# EAGLE design BelaExpander (EAGLE 7.5.0)
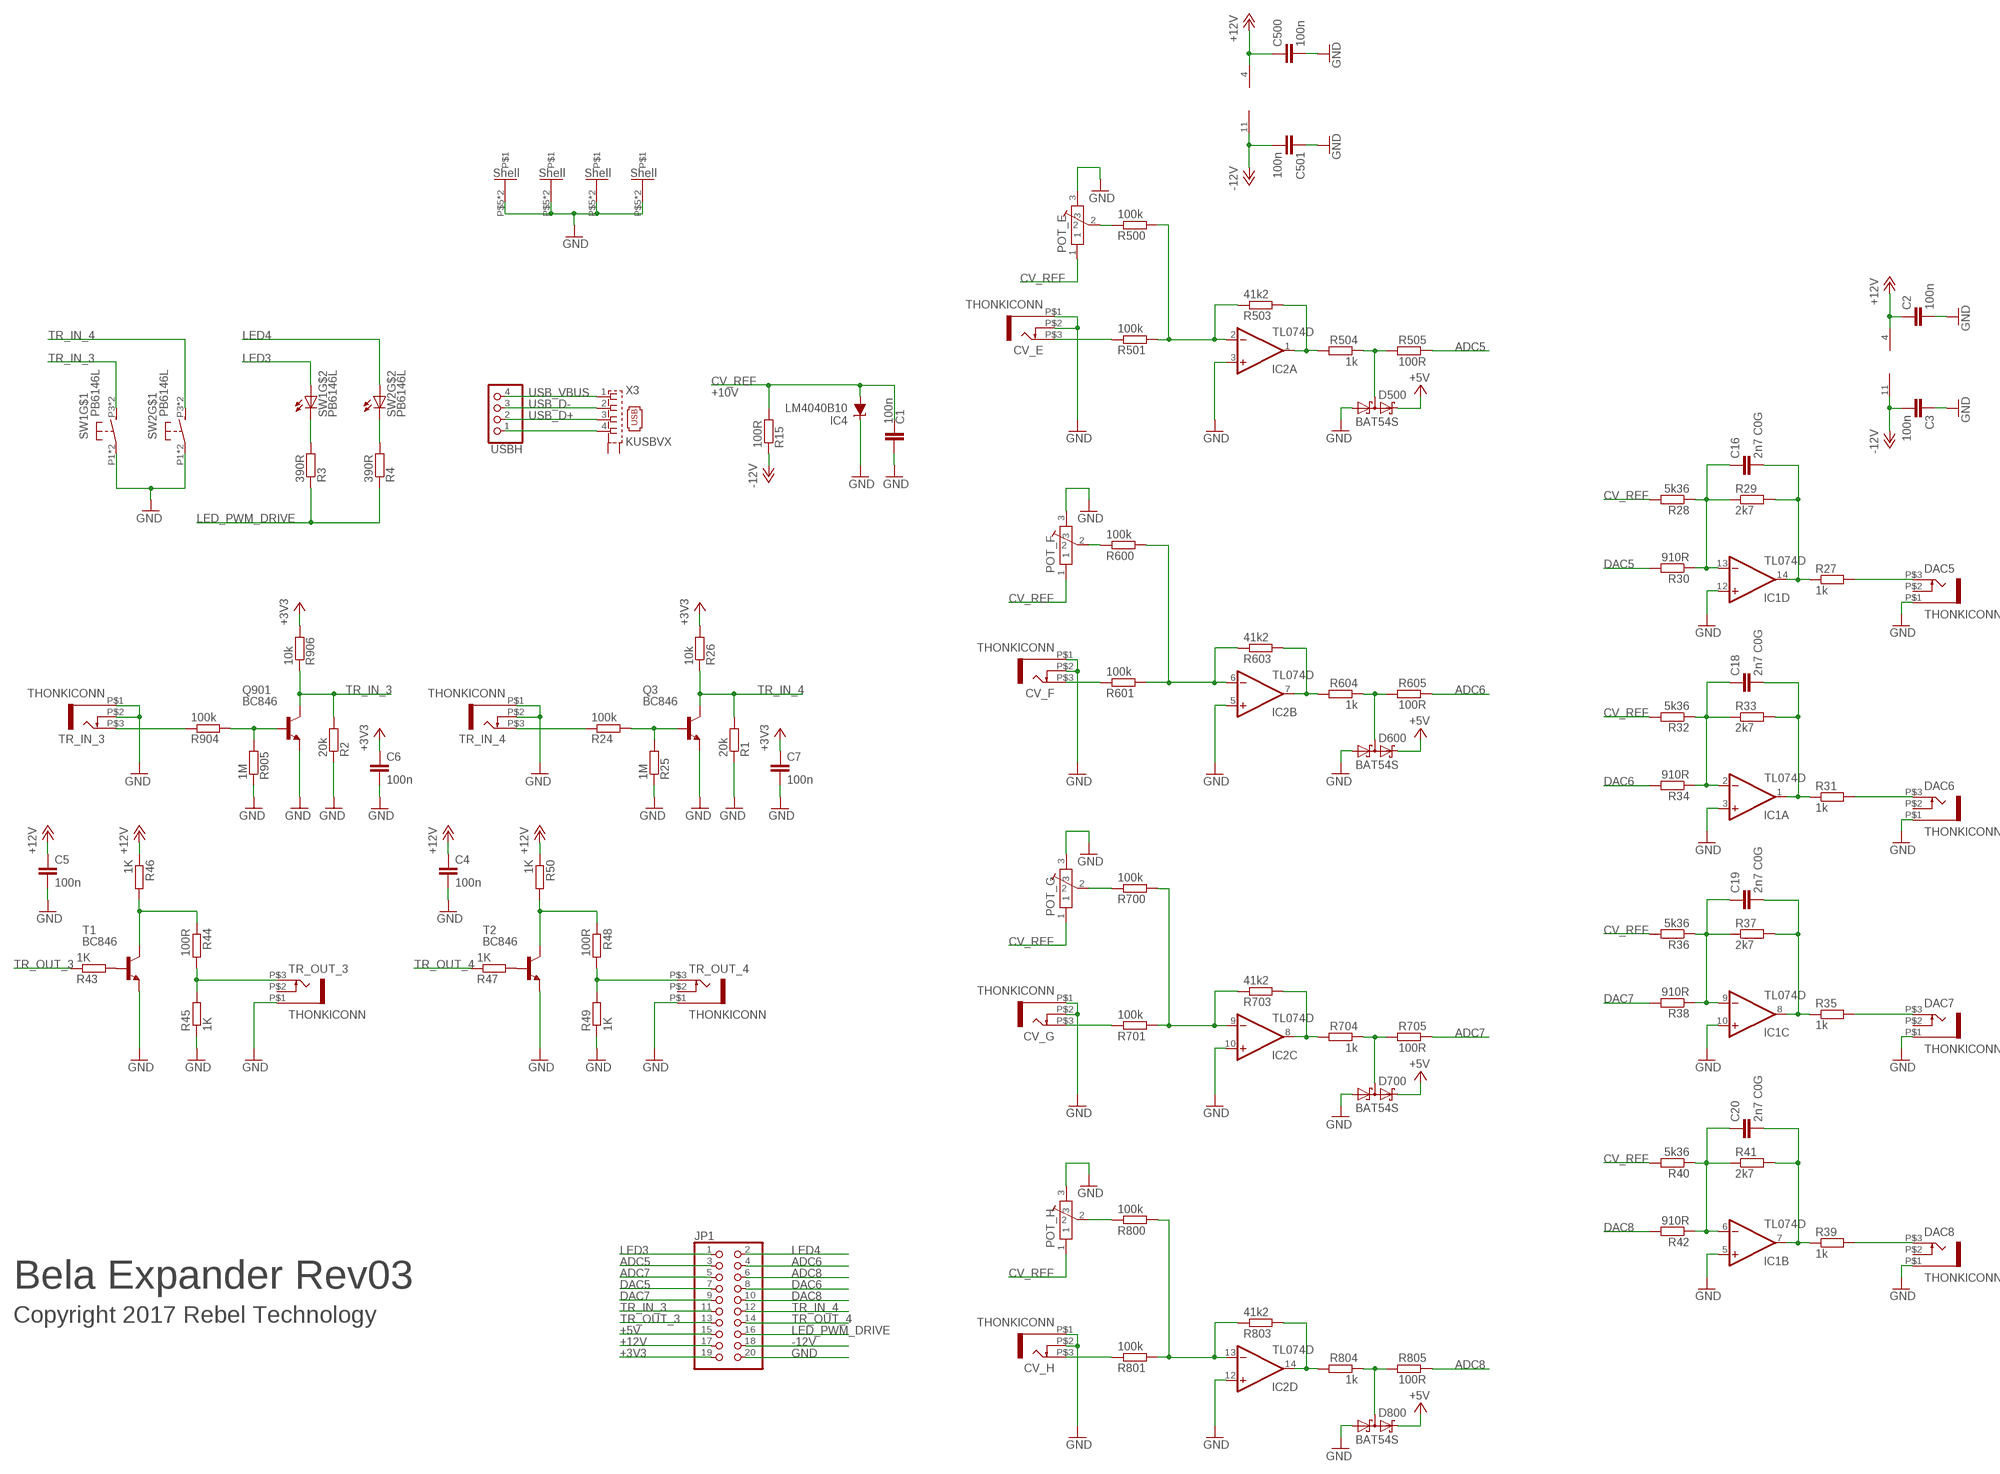
[diagram p0: schematic, sheet 1]

## Parts
C1  100n  C-EUC0603  [C0603]
C2  100n  C-EUC0603  [C0603]
C3  100n  C-EUC0603  [C0603]
C4  100n  C-EUC0603  [C0603]
C5  100n  C-EUC0603  [C0603]
C6  100n  C-EUC0603  [C0603]
C7  100n  C-EUC0603  [C0603]
C16  2n7 C0G  C-EUC0603  [C0603]
C18  2n7 C0G  C-EUC0603  [C0603]
C19  2n7 C0G  C-EUC0603  [C0603]
C20  2n7 C0G  C-EUC0603  [C0603]
C500  100n  C-EUC0603  [C0603]
C501  100n  C-EUC0603  [C0603]
CV_E  THONKICONN  [THONKICONN]
CV_F  THONKICONN  [THONKICONN]
CV_G  THONKICONN  [THONKICONN]
CV_H  THONKICONN  [THONKICONN]
D500  BAT54S  [SOT23]
D600  BAT54S  [SOT23]
D700  BAT54S  [SOT23]
D800  BAT54S  [SOT23]
DAC5  THONKICONN  [THONKICONN]
DAC6  THONKICONN  [THONKICONN]
DAC7  THONKICONN  [THONKICONN]
DAC8  THONKICONN  [THONKICONN]
IC1  TL074D  [SO14]
IC2  TL074D  [SO14]
IC4  LM4040B10  LM4041C12DBZ  [DBZ_R-PDSO-G3]
JP1  PINHD-2X10  [2X10]
POT_E  POT-ALPS-RK09L1140  [POT-ALPS-RK09L1140]
POT_F  POT-ALPS-RK09L1140  [POT-ALPS-RK09L1140]
POT_G  POT-ALPS-RK09L1140  [POT-ALPS-RK09L1140]
POT_H  POT-ALPS-RK09L1140  [POT-ALPS-RK09L1140]
Q3  BC846  [SOT23]
Q901  BC846  [SOT23]
R1  20k  R-EU_0603  [0603]
R2  20k  R-EU_0603  [0603]
R3  390R  R-EU_0603  [0603]
R4  390R  R-EU_0603  [0603]
R15  100R  R-EU_0603  [0603]
R24  100k  R-EU_0603  [0603]
R25  1M  R-EU_0603  [0603]
R26  10k  R-EU_0603  [0603]
R27  1k  R-EU_0603  [0603]
R28  5k36  R-EU_0603  [0603]
R29  2k7  R-EU_0603  [0603]
R30  910R  R-EU_0603  [0603]
R31  1k  R-EU_0603  [0603]
R32  5k36  R-EU_0603  [0603]
R33  2k7  R-EU_0603  [0603]
R34  910R  R-EU_0603  [0603]
R35  1k  R-EU_0603  [0603]
R36  5k36  R-EU_0603  [0603]
R37  2k7  R-EU_0603  [0603]
R38  910R  R-EU_0603  [0603]
R39  1k  R-EU_0603  [0603]
R40  5k36  R-EU_0603  [0603]
R41  2k7  R-EU_0603  [0603]
R42  910R  R-EU_0603  [0603]
R43  1K  R-EU_0603  [0603]
R44  100R  R-EU_0603  [0603]
R45  1K  R-EU_0603  [0603]
R46  1K  R-EU_0603  [0603]
R47  1K  R-EU_0603  [0603]
R48  100R  R-EU_0603  [0603]
R49  1K  R-EU_0603  [0603]
R50  1K  R-EU_0603  [0603]
R500  100k  R-EU_0603  [0603]
R501  100k  R-EU_0603  [0603]
R503  41k2  R-EU_0603  [0603]
R504  1k  R-EU_0603  [0603]
R505  100R  R-EU_0603  [0603]
R600  100k  R-EU_0603  [0603]
R601  100k  R-EU_0603  [0603]
R603  41k2  R-EU_0603  [0603]
R604  1k  R-EU_0603  [0603]
R605  100R  R-EU_0603  [0603]
R700  100k  R-EU_0603  [0603]
R701  100k  R-EU_0603  [0603]
R703  41k2  R-EU_0603  [0603]
R704  1k  R-EU_0603  [0603]
R705  100R  R-EU_0603  [0603]
R800  100k  R-EU_0603  [0603]
R801  100k  R-EU_0603  [0603]
R803  41k2  R-EU_0603  [0603]
R804  1k  R-EU_0603  [0603]
R805  100R  R-EU_0603  [0603]
R904  100k  R-EU_0603  [0603]
R905  1M  R-EU_0603  [0603]
R906  10k  R-EU_0603  [0603]
SW1  PB6146L  [PB6146L]
SW2  PB6146L  [PB6146L]
T1  BC846  [SOT23]
T2  BC846  [SOT23]
TR_IN_3  THONKICONN  [THONKICONN]
TR_IN_4  THONKICONN  [THONKICONN]
TR_OUT_3  THONKICONN  [THONKICONN]
TR_OUT_4  THONKICONN  [THONKICONN]
USBH  PINHD-1X4  [1X04]
X3  KUSBVX  [KUSBVX]

## Nets
+3V3: C6.1 C7.1 JP1.19 R26.2 R906.2
+5V: D500.2(C2) D600.2(C2) D700.2(C2) D800.2(C2) JP1.15
+12V: C2.1 C4.1 C5.1 C500.1 IC1.4(P:V+) IC2.4(P:V+) JP1.17 R46.1 R50.1
-12V: C3.2 C501.2 IC1.11(P:V-) IC2.11(P:V-) JP1.18 R15.1
ADC5: JP1.3 R505.1
ADC6: JP1.4 R605.1
ADC7: JP1.5 R705.1
ADC8: JP1.6 R805.1
CV_REF: C1.1 IC4.2(A) POT_E.1 POT_F.1 POT_G.1 POT_H.1 R15.2 R28.2 R32.2 R36.2 R40.2
DAC5: JP1.7 R30.2
DAC6: JP1.8 R34.2
DAC7: JP1.9 R38.2
DAC8: JP1.10 R42.2
GND: C1.2 C2.2 C3.1 C4.2 C5.2 C6.2 C7.2 C500.2 C501.1 CV_E.P$1 CV_E.P$2 CV_F.P$1 CV_F.P$2 CV_G.P$1 CV_G.P$2 CV_H.P$1 CV_H.P$2 D500.1(A1) D600.1(A1) D700.1(A1) D800.1(A1) DAC5.P$1 DAC6.P$1 DAC7.P$1 DAC8.P$1 IC1.3(A:+IN) IC1.5(B:+IN) IC1.10(C:+IN) IC1.12(D:+IN) IC2.3(A:+IN) IC2.5(B:+IN) IC2.10(C:+IN) IC2.12(D:+IN) IC4.1(C) JP1.20 POT_E.3 POT_E.P$5 POT_E.P$6 POT_F.3 POT_F.P$5 POT_F.P$6 POT_G.3 POT_G.P$5 POT_G.P$6 POT_H.3 POT_H.P$5 POT_H.P$6 Q3.2(E) Q901.2(E) R1.1 R2.1 R25.1 R45.1 R49.1 R905.1 SW1.P1(P) SW1.P2(P) SW2.P1(P) SW2.P2(P) T1.2(E) T2.2(E) TR_IN_3.P$1 TR_IN_3.P$2 TR_IN_4.P$1 TR_IN_4.P$2 TR_OUT_3.P$1 TR_OUT_4.P$1
LED3: JP1.1 SW1.PL1(A)
LED4: JP1.2 SW2.PL1(A)
LED_PWM_DRIVE: JP1.16 R3.1 R4.1
N$1: USBH.1 X3.4
N$3: CV_E.P$3 R501.1
N$5: R3.2 SW1.PL2(C)
N$6: IC2.9(C:-IN) R700.2 R701.2 R703.1
N$9: R4.2 SW2.PL2(C)
N$13: IC2.2(A:-IN) R500.2 R501.2 R503.1
N$14: POT_E.2 R500.1
N$16: D500.3(C1A2) R504.1 R505.2
N$17: IC2.1(A:OUT) R503.2 R504.2
N$19: CV_F.P$3 R601.1
N$20: IC2.6(B:-IN) R600.2 R601.2 R603.1
N$21: POT_F.2 R600.1
N$22: IC2.7(B:OUT) R603.2 R604.2
N$23: D600.3(C1A2) R604.1 R605.2
N$25: CV_G.P$3 R701.1
N$27: POT_G.2 R700.1
N$28: IC2.8(C:OUT) R703.2 R704.2
N$29: D700.3(C1A2) R704.1 R705.2
N$31: CV_H.P$3 R801.1
N$33: IC2.13(D:-IN) R800.2 R801.2 R803.1
N$34: POT_H.2 R800.1
N$35: IC2.14(D:OUT) R803.2 R804.2
N$36: D800.3(C1A2) R804.1 R805.2
N$37: Q901.1(B) R904.2 R905.2
N$38: R43.2 T1.1(B)
N$44: R44.1 R46.2 T1.3(C)
N$45: Q3.1(B) R24.2 R25.2
N$46: R904.1 TR_IN_3.P$3
N$47: R24.1 TR_IN_4.P$3
N$49: C16.2 IC1.14(D:OUT) R27.1 R29.2
N$50: C16.1 IC1.13(D:-IN) R28.1 R29.1 R30.1
N$51: DAC5.P$3 R27.2
N$52: C18.2 IC1.1(A:OUT) R31.1 R33.2
N$53: C18.1 IC1.2(A:-IN) R32.1 R33.1 R34.1
N$54: DAC6.P$3 R31.2
N$55: C19.2 IC1.8(C:OUT) R35.1 R37.2
N$56: C19.1 IC1.9(C:-IN) R36.1 R37.1 R38.1
N$57: DAC7.P$3 R35.2
N$58: C20.2 IC1.7(B:OUT) R39.1 R41.2
N$59: C20.1 IC1.6(B:-IN) R40.1 R41.1 R42.1
N$60: DAC8.P$3 R39.2
N$61: R44.2 R45.2 TR_OUT_3.P$3
N$62: R47.2 T2.1(B)
N$63: R48.1 R50.2 T2.3(C)
N$64: R48.2 R49.2 TR_OUT_4.P$3
TR_IN_3: JP1.11 Q901.3(C) R2.2 R906.1 SW1.P3(S) SW1.P4(S)
TR_IN_4: JP1.12 Q3.3(C) R1.2 R26.1 SW2.P3(S) SW2.P4(S)
TR_OUT_3: JP1.13 R43.1
TR_OUT_4: JP1.14 R47.1
USB_D+: USBH.2 X3.3
USB_D-: USBH.3 X3.2
USB_VBUS: USBH.4 X3.1
Unconnected: DAC5.P$2 DAC6.P$2 DAC7.P$2 DAC8.P$2 TR_OUT_3.P$2 TR_OUT_4.P$2 X3.M1(S1) X3.M2(S2)

## Notes on the sheet
- +10V
- Bela Expander Rev03
- Copyright 2017 Rebel Technology

## Library data of the parts
C1-C7 C500 C501 = resistor:C-EU: CAPACITOR, European symbol
C16 C18-C20 = Rebel:C-EU: CAPACITOR, European symbol
CV_E CV_F CV_G CV_H DAC5-DAC8 TR_IN_3 TR_IN_4 TR_OUT_3 TR_OUT_4 = Rebel:THONKICONN
D500 D600 D700 D800 = diode:BAT54S: Schottky Diodes Pin connection corrected 2011-05-04 Source: Fairchild .. BAT54.pdf
IC1 IC2 = linear:TL074: OP AMP
IC4 = texas:LM4041: PRECISION MICROPOWER SHUNT VOLTAGE REFERENCE Source: http://focus.ti.com/lit/ds/slcs146e/slcs146e.pdf; MF: TEXAS INSTRUMENT CONNECTORS; MPN: LM4041C12QDBZT; OC_FARNELL: 1771733; OC_NEWARK: 43K3376
JP1 = pinhead:PINHD-2X10: PIN HEADER
POT_E POT_F POT_G POT_H = Rebel:POT-ALPS-RK09L
Q3 Q901 T1 T2 = transistor:BC846: NPN TRANSISTOR
R1-R4 R15 R24-R50 R500 R501 R503-R505 R600 R601 R603-R605 R700 R701 R703-R705 R800 R801 R803-R805 R904-R906 = Rebel:R-EU_: RESISTOR, European symbol
SW1 SW2 = Rebel:PB6146L
USBH = pinhead:PINHD-1X4: PIN HEADER
X3 = con-kycon:KUSBVX: Vertical,Top Entry Universal Serial Bus Connector KUSBVX Series Source: KYCON Sibalco USB vertical socket KUSBV.pdf

## Net classes
1 power: width 0.178 mm, drill 0.305 mm, clearance 0.178 mm to class 0, clearance 0.178 mm

## Board
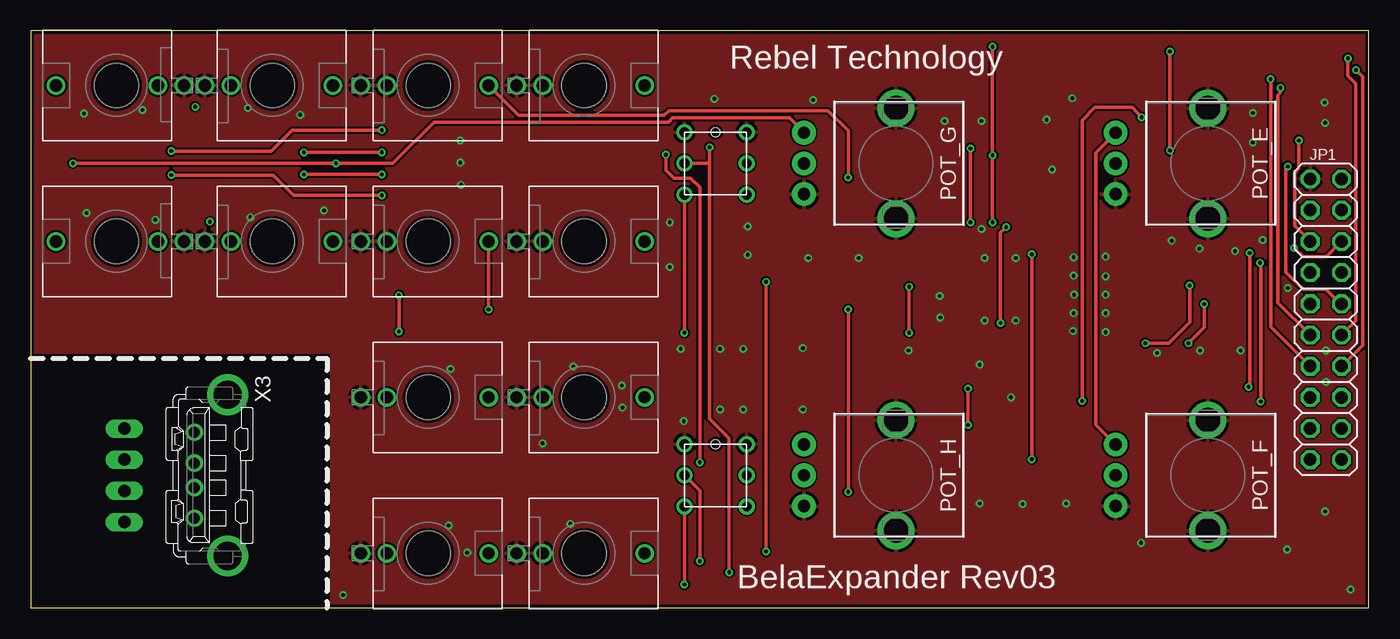
[diagram p1: board, top side]
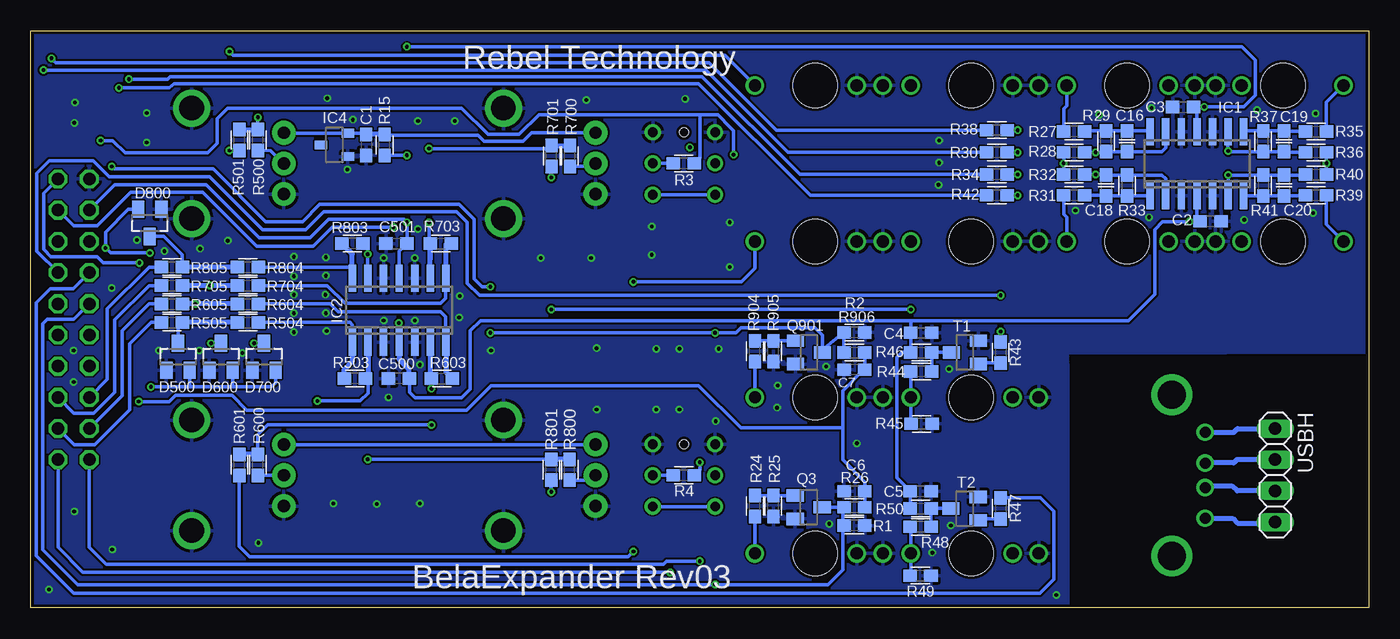
[diagram p2: board, bottom side, seen from below]

Size 109 x 47 mm. Coordinates in mm from the lower left corner, seen from the top.
Outline: 0,47 0,0 109,0 109,47 0,47
Copper layers (1*16): Top 0.035mm / dielectric 1.5mm / Bottom 0.035mm
Design rules "SeeedStudio_2layer_DRU_no_angle_20140221": minimum track width 6mil, minimum drill 12mil, track to track 6mil, track to pad 6mil, pad to pad 6mil, via to via 6mil, smd to smd 0mil, copper to edge 10mil, drill to drill 10mil, minimum pad ring 10mil, minimum via ring 6mil, stop-mask expansion 2mil, vias tented up to drill 100mil, thermal gap 10mil

### Footprints (pad centres in the part's own frame; a part is rotated, then mirrored left to right if it is on the bottom)
C0603 = smd 1.1 x 1: 1 -0.85,0; 2 0.85,0
THONKICONN = drill 1: P$1 0,-5.5; P$2 0,-3.38; P$3 0,4.92 | hole 3.6: 0,0
SOT23 = smd 1 x 1.4: 1 -0.95,-1.1; 2 0.95,-1.1; 3 0,1.1
SO14 = smd 0.6 x 2.2: 1 -3.81,-2.6; 2 -2.54,-2.6; 3 -1.27,-2.6; 4 0,-2.6; 5 1.27,-2.6; 6 2.54,-2.6; 7 3.81,-2.6; 8 3.81,2.6; 9 2.54,2.6; 10 1.27,2.6; 11 0,2.6; 12 -1.27,2.6; 13 -2.54,2.6; 14 -3.81,2.6
DBZ_R-PDSO-G3 = smd 0.7 x 1: 1 -0.95,-1.1; 2 0.95,-1.1; 3 0,1.1
2X10 = drill 1.016 octagon: 1 -11.43,-1.27; 2 -11.43,1.27; 3 -8.89,-1.27; 4 -8.89,1.27; 5 -6.35,-1.27; 6 -6.35,1.27; 7 -3.81,-1.27; 8 -3.81,1.27; 9 -1.27,-1.27; 10 -1.27,1.27; 11 1.27,-1.27; 12 1.27,1.27; 13 3.81,-1.27; 14 3.81,1.27; 15 6.35,-1.27; 16 6.35,1.27; 17 8.89,-1.27; 18 8.89,1.27; 19 11.43,-1.27; 20 11.43,1.27
POT-ALPS-RK09L1140 = drill 1 pad 1.93: 1 -2.5,-7.5; 2 0,-7.5; 3 2.5,-7.5 | drill 2: P$5 -4.5,0; P$6 4.5,0
0603 = smd 1.1 x 1: 1 -0.85,0; 2 0.85,0
PB6146L = drill 0.8: P1 -2.54,2.54; P2 2.54,2.54; P3 -2.54,-2.54; P4 2.54,-2.54; PL1 -2.54,0; PL2 2.54,0 | hole 0.7: 0,2.54
1X04 = drill 1.016 long: 1 -3.81,0; 2 -1.27,0; 3 1.27,0; 4 3.81,0
KUSBVX = drill 0.9 pad 1.3: 1 3.5,0; 2 1,0; 3 -1,0; 4 -3.5,0 | drill 2.3 pad 2.8: M1 -6.57,2.71; M2 6.57,2.71

### Placement (x,y rotation side)
C1  81.67,37.7 270 bottom
C2  12.88,31.49 0 bottom
C3  15.13,40.79 0 bottom
C4  36.45,22.4 0 bottom
C5  36.5,9.5 0 bottom
C6  41.9,9.5 180 bottom
C7  41.9,19.4 180 bottom
C16  19.7,38 90 bottom
C18  21.4,34.4 270 bottom
C19  6.9,38 90 bottom
C20  6.9,34.4 270 bottom
C500  79,18.67 180 bottom
C501  79.2,29.67 0 bottom
CV_E  45.09,42.55 270 top
CV_F  45.09,29.84 270 top
CV_G  32.38,42.55 270 top
CV_H  32.38,29.84 270 top
D500  97,20.45 0 bottom
D600  93.5,20.45 0 bottom
D700  90,20.45 0 bottom
D800  99.3,31.35 180 bottom
DAC5  19.68,42.55 270 top
DAC6  19.68,29.84 270 top
DAC7  6.99,42.55 90 top
DAC8  6.99,29.84 90 top
IC1  14,36.16 0 bottom
IC2  78.99,24.24 0 bottom
IC4  84.27,37.7 90 bottom
JP1  105.5,23.5 90 top
POT_E  95.89,36.2 270 top
POT_F  95.89,10.79 270 top
POT_G  70.48,36.2 270 top
POT_H  70.48,10.79 270 top
Q3  45.63,8.2 270 bottom
Q901  45.6,20.8 270 bottom
R1  41.9,6.7 180 bottom
R2  41.9,22.43 180 bottom
R3  55.8,36.2 180 bottom
R4  55.8,10.8 180 bottom
R15  80.17,37.7 90 bottom
R24  50,8.3 90 bottom
R25  48.5,8.3 90 bottom
R26  41.9,8.2 0 bottom
R27  24,38.8 180 bottom
R28  24,37.1 180 bottom
R29  21.4,38 90 bottom
R30  30.3,37.1 180 bottom
R31  24,33.6 180 bottom
R32  24,35.3 180 bottom
R33  19.7,34.4 270 bottom
R34  30.3,35.3 180 bottom
R35  4.3,38.8 0 bottom
R36  4.3,37.1 0 bottom
R37  8.6,38 90 bottom
R38  30.3,38.9 180 bottom
R39  4.3,33.6 0 bottom
R40  4.3,35.3 0 bottom
R41  8.6,34.4 270 bottom
R42  30.3,33.6 180 bottom
R43  30,20.8 270 bottom
R44  36.45,19.25 180 bottom
R45  36.42,14.99 180 bottom
R46  36.45,20.8 0 bottom
R47  30,8.1 270 bottom
R48  36.5,6.6 180 bottom
R49  36.52,2.62 180 bottom
R50  36.5,8.1 0 bottom
R500  90.5,38.1 90 bottom
R501  92,38.1 90 bottom
R503  82.6,18.67 180 bottom
R504  91.3,23.25 0 bottom
R505  97.5,23.25 0 bottom
R600  90.5,11.65 90 bottom
R601  92,11.65 90 bottom
R603  75.5,18.67 0 bottom
R604  91.3,24.75 0 bottom
R605  97.5,24.75 0 bottom
R700  65.07,36.8 90 bottom
R701  66.57,36.8 90 bottom
R703  75.6,29.67 0 bottom
R704  91.3,26.25 0 bottom
R705  97.5,26.25 0 bottom
R800  65.1,11.25 90 bottom
R801  66.6,11.25 90 bottom
R803  82.8,29.67 180 bottom
R804  91.3,27.75 0 bottom
R805  97.5,27.75 0 bottom
R904  50,20.9 90 bottom
R905  48.5,20.9 90 bottom
R906  41.9,20.8 0 bottom
SW1  55.78,36.2 0 top
SW2  55.78,10.79 0 top
T1  32.9,20.8 90 bottom
T2  32.93,8.09 90 bottom
TR_IN_3  45.09,17.14 270 top
TR_IN_4  45.09,4.45 270 top
TR_OUT_3  32.38,17.14 270 top
TR_OUT_4  32.38,4.45 270 top
USBH  7.62,10.79 270 bottom
X3  13.34,10.79 270 top

### Tracks (layer width: path | path; a pad name or v marks a point on that pad's centre or on a via)
+3V3  (via drill 0.3)
  Top 0.305: v100.2,16.8 100.2,28.05 v100.15,28.1
  Bottom 0.305: R26.2 C6.1 41.05,10.25 42.85,12.05 42.85,14.7 | v100.15,28.1 103.1,28.1 103.6,28.6 107.35,28.6 107.95,29.2 107.95,33.74 JP1.19 | 42.9,14.65 51.15,14.65 54.6,18.1 71.5,18.1 73.5,16.1 91.4,16.1 92.6,17.3 97.2,17.3 97.7,16.8 v100.2,16.8 | 42.9,14.65 42.85,14.7 | 42.9,14.65 42.85,14.65 | 42.85,14.7 42.85,17.7 41.15,19.4 C7.1 R906.2
+5V  (via drill 0.3)
  Top 0.305: JP1.15 105.53,28.6 103.7,28.6 v102.9,29.3 | v99.2,18 99.3,18 v99.3,28.9
  Bottom 0.305: D700.2 89.05,18.35 89.4,18 92.5,18 | 92.5,18 96.1,18 | 96.1,18 v99.2,18 | D600.2 92.55,18.05 92.5,18 | D500.2 96.05,18.05 96.1,18 | v99.3,28.9 102.5,28.9 v102.9,29.3 102.9,30.6 101.05,32.45 D800.2
+12V  (via drill 0.3)
  Top 0.305: v79.45,31 79,30.55 v79,23.2 79,24.3
  Bottom 0.305: IC1.4 14,31.76 C2.1 13.77,31.45 v14.6,31.45 16.8,31.45 17.45,30.8 17.45,25.55 19.6,23.4 37.4,23.4 | R50.1 C5.1 38.45,10.6 38.45,20.4 38.05,20.8 R46.1 C4.1 37.3,23.3 37.4,23.4 | 37.4,23.4 72.35,23.4 73.2,22.55 73.2,17.8 73.9,17.1 77.7,17.1 78.15,17.55 C500.1 | JP1.17 106.77,32.37 105.5,31.1 103.6,31.1 100.85,33.85 95,33.85 90.6,29.45 86,29.45 84.45,31 v79.45,31 | v79,23.2 IC2.4
  Bottom 0.406: IC2.4 78.99,20.26 78.2,19.47 78.2,18.72 C500.1
-12V  (via drill 0.3)
  Top 0.305: v78.35,45.7 v78.35,36.85 | v78.35,36.85 78.35,36.8 | v78.35,31.4 v78.35,36.85
  Bottom 0.305: IC1.11 14,40.51 C3.2 v13.4,40.8 10.2,40.8 9.25,41.75 9.25,44.6 10.35,45.7 v78.35,45.7 | IC2.11 78.99,29.03 C501.2 v78.35,31.4 78.6,31.65 84.75,31.65 86.25,30.15 90.4,30.15 94.7,34.45 102.15,34.45 104.22,32.38 JP1.18 | v78.35,36.85 R15.1
ADC5
  Bottom 0.305: JP1.3 105.47,13.3 103.8,13.3 100.95,16.15 100.95,21.5 99.2,23.25 R505.1
ADC6
  Bottom 0.305: JP1.4 101.55,17.29 101.55,22.55 99.35,24.75 R605.1
  Bottom 0.406: R605.1 98.61,25.01
ADC7
  Bottom 0.305: JP1.5 105.47,15.85 103.85,15.85 102.15,17.55 102.15,23.45 99.35,26.25 R705.1
ADC8
  Bottom 0.305: JP1.6 104.2,17.14 102.75,18.6 102.75,24.35 99.35,27.75 R805.1
CV_REF  (via drill 0.3)
  Top 0.305: v3.45,36.2 v24.85,36.2 29.5,36.2 32.85,39.55 51.95,39.55 52.3,39.9 61.8,39.9 62.98,38.72 POT_G.1 | POT_F.1 86.75,14.93 86.75,37.06 POT_E.1
  Bottom 0.305: R40.2 v3.45,36.2 R36.2 | R32.2 v24.85,36.2 R28.2 | C1.1 81.77,38.65 IC4.2 88.29,38.65 POT_E.1 | POT_H.1 POT_F.1 | 80.03,38.7 R15.2 80.12,38.5 72.55,38.5 72.05,38 68.9,38 68.2,38.7 POT_G.1
  Bottom 0.406: 81.77,38.35 arc90 C1.1 R15.2
DAC5  (via drill 0.3)
  Top 0.305: JP1.7 106.78,19.68 108.5,21.4 108.5,43.25 v107.95,43.8
  Bottom 0.305: R30.2 47.3,37.1 54,43.8 v107.95,43.8
DAC6  (via drill 0.3)
  Top 0.305: JP1.8 104.22,19.68 101,22.9 v101,43.05
  Bottom 0.305: R34.2 46.35,35.3 54.3,43.25 97.65,43.25 97.85,43.05 v101,43.05
DAC7  (via drill 0.3)
  Top 0.305: JP1.9 107.95,23.4 107.95,42.7 107.3,43.35 v107.3,44.75
  Bottom 0.305: R38.2 48.25,38.9 53.75,44.4 106.95,44.4 v107.3,44.75
DAC8  (via drill 0.3)
  Top 0.305: JP1.10 101.6,24.85 101.6,41.75 101.8,41.95 v101.8,42.35
  Bottom 0.305: R42.2 45.5,33.6 54.6,42.7 97.3,42.7 97.7,42.35 v101.8,42.35
GND  (via drill 0.3)
  other vias: 77.7,23.4 80.25,23.4 79.85,17.15 77.7,28.5 80.25,28.5 77.45,30.85 84.95,28.55 10.15,31.6 4.55,32.15 4.35,40.25 9.1,40.55 17.7,40.7 21.95,40.15 17.9,31.8 23.9,32.35 35,36.25 35,38.05 35.05,34.45 83.2,35.7 95.2,29.25 98.55,20.95 95.25,20.95 91.75,20.75 77.3,19.8 74.05,25.4 74.1,23.65 48.15,18.1 48.2,16.3 80.8,8.45 71.5,20.95 102.35,4.75 107.5,1.5 90.45,5.3 25.45,1.05 35.55,4.5 34.05,6.7 43.95,6.85 56.15,21.1 56.15,16.15 58.4,28.75 58.4,31.05 52.05,27.75 52.05,31.4 52.95,21.1 58.05,21.1 58.05,16.15 62.9,21.15 62.9,16.15 53.2,15.2 41.7,13.4 55.7,41.45 63.75,41.35 84.85,41.5 105.4,41.15 105.45,39.5 99.55,40.3 99.55,37.9 92.95,29.9 63.35,28.5 67.45,28.5 84.35,8.5 77.3,8.5 98.1,29.05 102.4,26.05 74.45,39.65 77.45,39.65 82.75,39.75 84.95,27.05 84.9,22.55 87.55,22.45 87.55,28.6 105.45,7.85 100.35,29.95 105.5,20.95 105.5,18.4 87.55,25.5 87.55,24 87.55,27 84.95,24 85,25.5 44.2,19.65 34.2,19.45
  pour Bottom: -1.4,49.53 109.86,49.53 109.86,-1.3 24.5,-1.3 24.5,17.93 24.5,19.05 24.56,20.73 -1.4,20.8
  pour Top: -2.54,50.8 110.49,50.8 110.49,-2.5 24.5,-2.5 24.5,17.96 24.49,17.95 24.56,20.76 -2.5,20.8
LED3  (via drill 0.3)
  Top 0.305: 55.3,36.1 v55.3,37.5 | SW1.PL1 55.2,36.2 55.3,36.1 | 55.3,36.1 55.3,15.4 56.9,13.8 v56.9,2.9
  Bottom 0.305: JP1.1 106.77,4.92 104.75,2.9 v56.9,2.9
LED4  (via drill 0.3)
  Top 0.305: SW2.PL1 54.5,9.54 v54.5,3.8
  Bottom 0.305: JP1.2 104.23,4.93 102.85,3.55 57.45,3.55 57.2,3.8 v54.5,3.8
LED_PWM_DRIVE  (via drill 0.3)
  Top 0.305: JP1.16 102.95,31.12 102.95,35.45 103.3,35.8 v103.3,38.05 | v54.5,11.85 54.5,34.25 53.75,35 52.4,35 51.75,35.65 v51.75,36.9
  Bottom 0.305: v54.5,11.85 54.5,11.25 R4.1 | v51.75,36.9 51.75,38.85 52,39.1 53,40.15 54.5,40.15 | 54.5,40.15 67.6,40.15 69.2,38.55 71.75,38.55 73.9,40.7 92.95,40.7 93.8,39.85 93.8,37.85 94.6,37.05 101.3,37.05 102.3,38.05 v103.3,38.05 | R3.1 54.5,36.65 54.5,40.15
N$1
  Bottom 0.406: X3.4 11.01,14.29 10.7,14.6 USBH.1
N$3  (via drill 0.3)
  Top 0.305: v92.8,37.25 v92.8,45.3
  Bottom 0.305: CV_E.P$3 52.46,45 92.5,45 v92.8,45.3 | R501.1 v92.8,37.25
N$5
  Bottom 0.305: R3.2 SW1.PL2
N$6  (via drill 0.3)
  Top 0.305: v76.55,31.4 v76.55,37.4
  Bottom 0.305: 76.55,29.82 v76.55,31.4 | R701.2 66.82,37.4 v76.55,37.4
  Bottom 0.406: R701.2 R700.2 | IC2.9 R703.1 | R703.1 76.55,29.82 | R703.1 76.45,28.42
N$9
  Bottom 0.305: R4.2 58.65,10.79 SW2.PL2
N$13  (via drill 0.3)
  Top 0.305: v85.65,16.85 85.65,39.7 86.7,40.75 89.75,40.75 90.5,39.9 v90.5,39.95
  Bottom 0.305: IC2.2 81.53,17.47 82.15,16.85 v85.65,16.85 | v90.5,39.95 R500.2
  Bottom 0.406: R501.2 R500.2 | IC2.2 81.53,18.69 R503.1
N$14
  Bottom 0.305: POT_E.2 89.45,37.24 R500.1
N$16
  Bottom 0.305: D500.3 97,22.9
  Bottom 0.406: 97,22.9 arc90 R505.2 R504.1
N$17
  Bottom 0.305: R504.2 83,23.25 82.8,23.05 IC2.1
  Bottom 0.406: IC2.1 82.8,20.07 83.5,19.37 83.5,18.72 R503.2 | 82.8,22.07 IC2.1 | 82.83,21.67 IC2.1
N$19  (via drill 0.3)
  Top 0.305: v59.9,4.6 v59.9,26.55
  Bottom 0.305: R601.1 92,5 91.15,4.15 60.35,4.15 v59.9,4.6 | v59.9,26.55 51.1,26.55 50.01,27.64 CV_F.P$3
N$20  (via drill 0.3)
  Top 0.305: v76.35,17.85 v76.35,14.9
  Bottom 0.305: R600.2 90.5,14.1 89.7,14.9 v76.35,14.9 | R603.1 v76.35,17.85
  Bottom 0.406: R600.2 R601.2 | IC2.6 76.45,19.17 R603.1
N$21
  Bottom 0.305: POT_F.2 R600.1
N$22
  Bottom 0.305: R604.2 84.6,24.75 83.95,24.1 75.6,24.1 75.2,23.7 75.2,21.66
  Bottom 0.406: 75.2,21.66 IC2.7 75.18,19.2 R603.2
N$23  (via drill 0.3)
  Top 0.305: v94.3,21.55 95.6,22.85 v95.6,24.75
  Bottom 0.406: R604.1 v95.6,24.75 R605.2 | D600.3 v94.3,21.55
N$25  (via drill 0.3)
  Top 0.305: v66.6,35.05 66.6,38.85 64.95,40.5 52,40.5 51.6,40.1 39.75,40.1 CV_G.P$3
  Bottom 0.305: v66.6,35.05 66.6,35.92 R701.1
N$27
  Bottom 0.305: R700.1 63.23,35.95 POT_G.2
N$28
  Bottom 0.305: R704.2 84.85,26.25 83.4,24.8 75.6,24.8 75.2,25.2 75.2,26.82 IC2.8
  Bottom 0.406: IC2.8 75.18,29.6 R703.2
N$29  (via drill 0.3)
  Top 0.305: v90.8,21.55 92.7,21.55 94.4,23.25 v94.4,26.25
  Bottom 0.406: R704.1 v94.4,26.25 R705.2 | v90.8,21.55 D700.3
N$31  (via drill 0.3)
  Top 0.305: v66.6,24.3 v66.6,9.45 | CV_H.P$3 v37.3,24.3
  Bottom 0.305: v66.6,24.3 v37.3,24.3 | v66.6,9.45 R801.1
N$33  (via drill 0.3)
  Top 0.305: v81.55,12.1 v81.55,28.8
  Bottom 0.305: R801.2 v81.55,12.1 | R803.1 81.55,29.67 v81.55,28.8 81.55,26.84 IC2.13
  Bottom 0.406: R800.2 R801.2
N$34
  Bottom 0.305: R800.1 63.38,10.4 POT_H.2
N$35
  Bottom 0.305: R804.2 83.05,27.75 82.8,27.5
  Bottom 0.406: 82.83,26.87 IC2.14 82.8,27.5 82.8,28.82 R803.2
N$36
  Bottom 0.305: R805.2 96.65,28.75 98.15,30.25 D800.3
  Bottom 0.406: R804.1 R805.2
N$37
  Bottom 0.305: Q901.1 R905.2 R904.2
N$38
  Bottom 0.305: R43.2 31.7,19.95 T1.1
N$44
  Bottom 0.305: R44.1 R46.2 T1.3
N$45
  Bottom 0.305: Q3.1 R25.2 R24.2
N$46
  Bottom 0.305: TR_IN_3.P$3 50.01,20.14 R904.1
N$47
  Bottom 0.305: R24.1 TR_IN_4.P$3
N$49
  Bottom 0.305: IC1.14 17.9,38.85 C16.2 R29.2 23.1,38.85 R27.1
N$50  (via drill 0.3)
  Top 0.305: v28.6,37.1 v22.25,37.1
  Bottom 0.305: IC1.13 16.54,37.46 16.85,37.15 C16.1 R29.1 21.45,37.1 v22.25,37.1 R28.1 | v28.6,37.1 R30.1
N$51
  Bottom 0.305: R27.2 24.85,40.65 24.6,40.9 DAC5.P$3
N$52
  Bottom 0.305: IC1.1 R33.2 C18.2 21.45,33.6 R31.1
N$53  (via drill 0.3)
  Top 0.305: v28.6,35.3 v22.25,35.3
  Bottom 0.305: IC1.2 16.54,34.94 16.85,35.25 R33.1 C18.1 21.45,35.3 v22.25,35.3 R32.1 | v28.6,35.3 R34.1
N$54
  Bottom 0.305: R31.2 24.85,32.05 24.6,31.8 DAC6.P$3
N$55
  Bottom 0.305: IC1.8 10.1,38.85 R37.2 C19.2 6.85,38.8 R35.1
N$56  (via drill 0.3)
  Top 0.305: v11.45,37.2 19.6,37.2 21.3,38.9 v28.6,38.9
  Bottom 0.305: 11.5,37.15 R37.1 C19.1 6.85,37.1 R36.1 | 11.5,37.15 11.5,38.72 IC1.9 | R38.1 v28.6,38.9 | 11.5,37.15 v11.45,37.2
N$57
  Bottom 0.305: R35.2 3.45,41.16 DAC7.P$3
N$58
  Bottom 0.305: IC1.7 R41.2 C20.2 5.2,33.55 R39.1
N$59  (via drill 0.3)
  Top 0.305: v11.45,35.25 19.75,35.25 21.4,33.6 v28.6,33.6
  Bottom 0.305: IC1.6 11.46,34.94 v11.45,35.25 R41.1 C20.1 5.2,35.25 R40.1 | R42.1 v28.6,33.6
N$60
  Bottom 0.305: R39.2 3.45,31.23 DAC8.P$3
N$61
  Bottom 0.305: R45.2 37.3,15.03 TR_OUT_3.P$3 R44.2
N$62
  Bottom 0.305: R47.2 31.72,7.25 T2.1
N$63
  Bottom 0.305: R48.1 R50.2 T2.3
N$64
  Bottom 0.305: R48.2 37.3,6.55 TR_OUT_4.P$3 37.3,2.69 R49.2
TR_IN_3  (via drill 0.3)
  Top 0.305: JP1.11 106.69,24.77 105.5,25.95 103.65,25.95 102.25,27.35 102.25,35.8 v102.4,35.95 | v71.55,26.15 v71.55,22.4 | SW1.P3 53.24,22.45 v53.25,22.4
  Bottom 0.305: v71.55,26.15 72.25,26.15 72.9,26.8 72.9,31.65 74.1,32.85 85.45,32.85 86.85,31.45 89.85,31.45 94.15,35.75 102.2,35.75 v102.4,35.95 | R906.1 R2.2 44.5,21.03 Q901.3 44.5,22.2 45.1,22.8 51.15,22.8 51.55,22.4 v53.25,22.4 v71.55,22.4 | SW1.P3 SW1.P4
TR_IN_4  (via drill 0.3)
  Top 0.305: SW2.P3 53.24,2.04 v53.25,1.9
  Bottom 0.305: R26.1 Q3.3 43,8.2 42.85,8.1 42.85,6.7 | 42.85,6.7 42.85,3.1 44.05,1.9 v53.25,1.9 105.15,1.9 108,4.75 108,23.15 107.65,23.5 105.5,23.5 JP1.12 | 42.85,6.7 R1.2 | SW2.P3 SW2.P4
TR_OUT_3  (via drill 0.3)
  Top 0.305: v30,25.45 v30,22.5
  Bottom 0.305: JP1.13 106.77,27.32 108.5,29.05 108.5,35.4 107.5,36.4 103.9,36.4 102.6,35.1 94.4,35.1 90.1,30.8 86.6,30.8 85.15,32.25 74.3,32.25 73.45,31.4 73.45,26.45 72.45,25.45 v30,25.45 | v30,22.5 R43.1
TR_OUT_4
  Bottom 0.305: R47.1 26.75,8.95 25.65,7.85 25.65,2.35 26.8,1.2 105.5,1.2 108.55,4.25 108.55,24.85 107.4,26 105.53,26 JP1.14
USB_D+
  Bottom 0.406: USBH.2 10.73,12.06 11,11.8 X3.3
USB_D-
  Bottom 0.406: USBH.3 10.72,9.53 11.1,9.9 13.23,9.9 X3.2
USB_VBUS
  Bottom 0.406: X3.1 11.1,7.29 10.7,6.9 7.71,6.9 USBH.4

### Text on the board
tPlace: Rebel Technology | BelaExpander Rev03
bPlace: Rebel Technology | BelaExpander Rev03